# Altium schematic sheet screw and Hole.SchDoc
size 297 x 209 mm; SheetNumber: 29; SheetTotal: 29
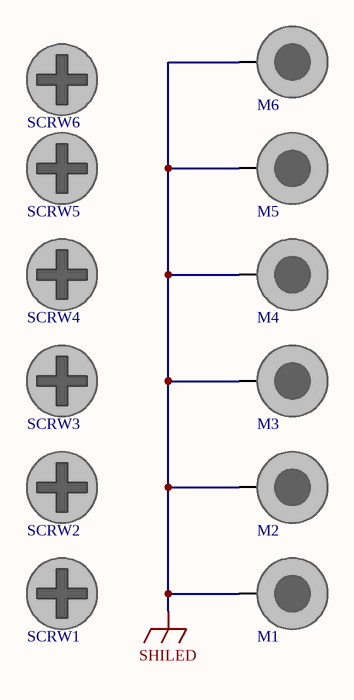
[diagram p0: screw and Hole.SchDoc]

## Parts
M1  DNP/MH  [SCMH_M3]  (value not drawn)  (no BOM)
M2  DNP/MH  [SCMH_M3]  (value not drawn)  (no BOM)
M3  DNP/MH  [SCMH_M3]  (value not drawn)  (no BOM)
M4  DNP/MH  [SCMH_M3]  (value not drawn)  (no BOM)
M5  DNP/MH  [SCMH_M3]  (value not drawn)  (no BOM)
M6  DNP/MH  [SCMH_M3]  (value not drawn)  (no BOM)
SCRW1  SCREW  [SCRW_PANH_PHLIPS_M3X5]  (value not drawn)
SCRW2  SCREW  [SCRW_PANH_PHLIPS_M3X5]  (value not drawn)
SCRW3  SCREW  [SCRW_PANH_PHLIPS_M3X5]  (value not drawn)
SCRW4  SCREW  [SCRW_PANH_PHLIPS_M3X5]  (value not drawn)
SCRW5  SCREW  [SCRW_PANH_PHLIPS_M3X5]  (value not drawn)
SCRW6  SCREW  [SCRW_PANH_PHLIPS_M3X5]  (value not drawn)

## Nets
SHILED: M1.1 M2.1 M3.1 M4.1 M5.1 M6.1

## Notes on the sheet
- Drawn
- Name
- Date
- Drawing Title
- Checked
- Drawing No.
- Approved
- Size
- A4
- Ver.
- Rev.
- Sheet
- Of

## Library data of the parts
M1-M6 = SCMH_M3: SCREW mouting, M3, 3.0mm diameter and 6.0mm PanHead; ASSEMBLY: DNP; VALUE: DNP/MH
SCRW1-SCRW6 = SCRW_PANH_PHLIPS_M3X5: SCREW, M3, 3.0mm diameter and 6.0mm PanHead; ASSEMBLY: DNP; VALUE: SCREW